# Altium schematic sheet 4_SIM卡座电路.SchDoc
size A4
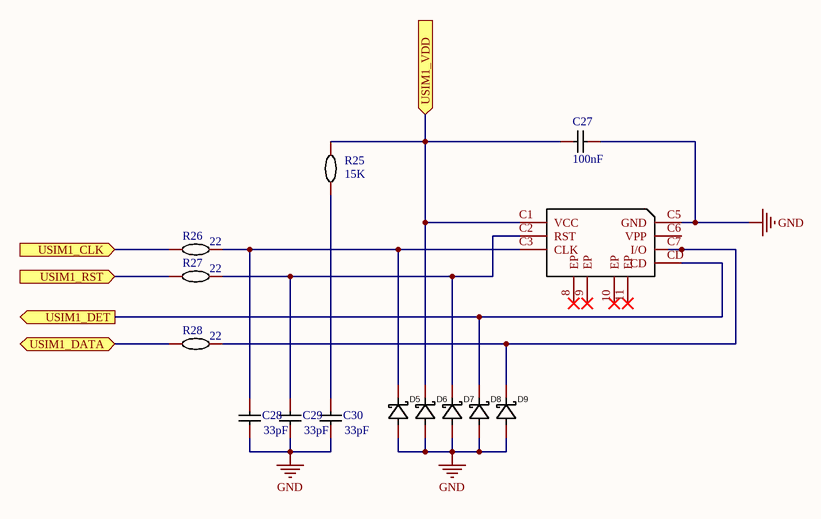
[diagram p0: 4_SIM卡座电路.SchDoc]

## Parts
C27  100nF  [0603C]
C28  33pF  [0402C]
C29  33pF  [0402C]
C30  33pF  [0402C]
CARD1  SMN-303  [SIM-SMD_SMN-303]  (value not drawn)
D5  (no value)  [SOD-123FL_L2.8-W1.8-LS3.7-RD]
D6  (no value)  [SOD-123FL_L2.8-W1.8-LS3.7-RD]
D7  (no value)  [SOD-123FL_L2.8-W1.8-LS3.7-RD]
D8  (no value)  [SOD-123FL_L2.8-W1.8-LS3.7-RD]
D9  (no value)  [SOD-123FL_L2.8-W1.8-LS3.7-RD]
R25  Name: 15K  [0603R]  (hidden comment: 4.7K)
R26  22  [0402R]
R27  22  [0402R]
R28  22  [0402R]

## Ports
USIM1_CLK (in), USIM1_DATA (bidir), USIM1_DET (out), USIM1_RST (in), USIM1_VDD (in)

## Nets
GND: C27.1 C28.1 C29.1 C30.1 CARD1.C5(GND) D5.2(A) D6.2(A) D7.2(A) D8.2(A) D9.2(A)
USIM1_CLK: R26.1 ; port USIM1_CLK
USIM1_DATA: R28.1 ; port USIM1_DATA
USIM1_DET: CARD1.CD D8.1(K) ; port USIM1_DET
USIM1_RST: R27.1 ; port USIM1_RST
USIM1_VDD: C27.2 CARD1.C1(VCC) D6.1(K) R25.2 ; port USIM1_VDD
NetC28_2: C28.2 CARD1.C3(CLK) D5.1(K) R26.2
NetC29_2: C29.2 CARD1.C2(RST) D7.1(K) R27.2
NetC30_2: C30.2 R25.1
NetCARD1_C7: CARD1.C7(I/O) D9.1(K) R28.2

Not connected (* = marked no-connect by the designer): CARD1 8(EP)* 9(EP)* 10(EP)* 11(EP)* C6(VPP)

## Library data of the parts
C27-C30 = CL31A106KBHNNNE: Add into BOM: yes; Value: 10uF; Voltage Rated: 50V; Temperature Coefficient: X5R; Symbol: CL31A106KBHNNNE; Device: CL31A106KBHNNNE; Supplier Part: C13585; Manufacturer Part: CL31A106KBHNNNE; Supplier Footprint: 1206; JLCPCB Part Class: Basic Part; Datasheet: https://atta.szlcsc.com/upload/public/pdf/source/20160103/1457707668742.pdf; Supplier: LCSC; Convert to PCB: yes; Name: 10uF
CARD1 = SMN-303: Add into BOM: yes; Body Height (Max): 1.37mm; Symbol: SMN-303; Device: SMN-303; Supplier: LCSC; Supplier Part: C266888; Manufacturer Part: SMN-303; JLCPCB Part Class: Extended Part; Supplier Footprint: SMD; Datasheet: https://atta.szlcsc.com/upload/public/pdf/source/20230608/69FA23A73293DEADC31E393DD83871F4.pdf; Convert to PCB: yes; Contact Material: C5191
D5-D9 = SMF75A_C5116416: Manufacturer Part: SMF75A; Add into BOM: yes; Reverse Stand-Off Voltage (Vrwm): 75V; Maximum Clamping Voltage: 121V; Peak Pulse Current (Ipp)@10/1000us: 1.4A; Peak Pulse Power Dissipation (Ppp)@10/1000us: 200W; Breakdown Voltage: 92.1V; Reverse Leakage Current (Ir): 1uA; Symbol: SMF75A_C5116416; Device: SMF75A_C5116416; Supplier: LCSC; Supplier Part: C5116416; Supplier Footprint: SOD-123FL; JLCPCB Part Class: Extended Part; Datasheet: https://atta.szlcsc.com/upload/public/pdf/source/20220715/82D6503F9C43F0DF9BB8970EC229759F.pdf; Convert to PCB: yes
R25 = RMC06034.7k5%N: Manufacturer: Tyohm; Convert to PCB: yes; Origin Footprint: R0603; Symbol: 4.7K; Device: RMC06034.7k5%N; Supplier: LCSC; Supplier Part: C269694; Manufacturer Part: RMC06034.7k5%N; JLCPCB Part Class: Extended Part; Add into BOM: yes
R26-R28 = Res_0402: Convert to PCB: yes; Value: 20; Device: Res_0402; Add into BOM: yes; Supplier Footprint: 0402; Name: 20